# EAGLE schematic headamp (EAGLE 7.6.0)
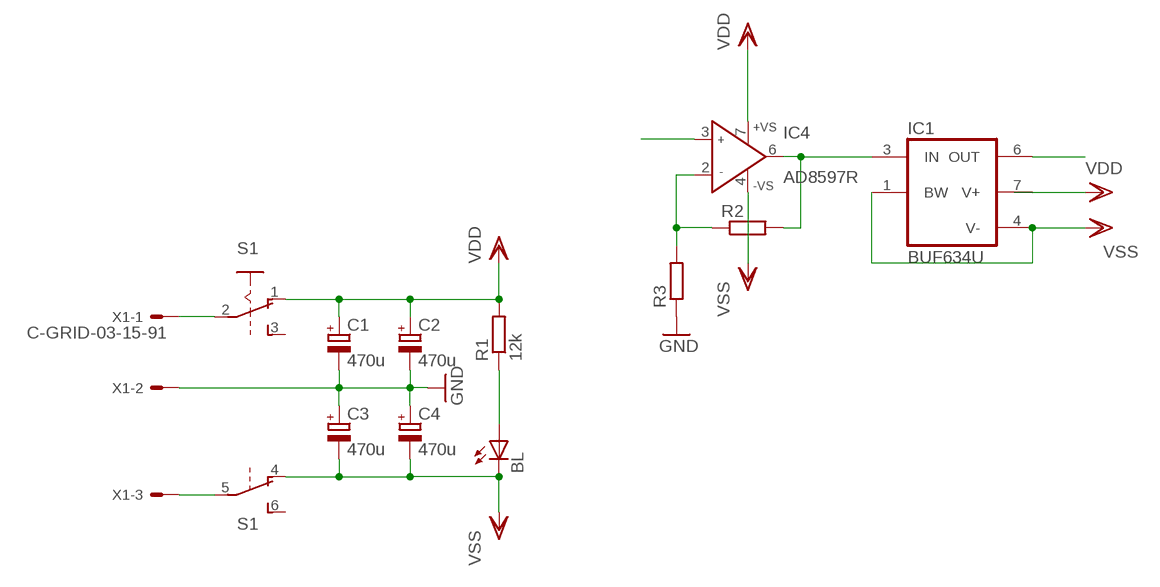
[diagram p0: schematic, sheet 1]

## Parts
BL  LEDCHIPLED_0805  [CHIPLED_0805]
C1  470u  CPOL-EUC  [PANASONIC_C]
C2  470u  CPOL-EUC  [PANASONIC_C]
C3  470u  CPOL-EUC  [PANASONIC_C]
C4  470u  CPOL-EUC  [PANASONIC_C]
IC1  BUF634U  [SO08]
IC4  AD8597R  [SO8]
R1  12k  R-EU_R0805  [R0805]
R2  R-EU_R1206  [R1206]
R3  R-EU_R1206  [R1206]
S1  A68-A31  [A68-A31]
X1  C-GRID-03-15-91  [15-91-03]

## Nets
GND: C1.- C2.- C3.+ C4.+ R3.1 X1.2
N$3: IC1.6(OUT)
N$4: S1.5(B:P) X1.3
N$6: IC1.3(IN) IC4.6(OUT) R2.2
N$7: S1.2(A:P) X1.1
N$8: BL.A R1.1
N$9: IC4.2(IN-) R2.1 R3.2
N$10: IC4.3(IN+)
VDD: C1.+ C2.+ IC4.7(+VS) R1.2 S1.1(A:O)
VSS: BL.C C3.- C4.- IC1.1(BW) IC1.4(V-) IC4.4(-VS) S1.4(B:O)
Unconnected: S1.3(A:S) S1.6(B:S)

## Power pins joined to a net without a drawn wire
V+: IC1.7(V+)

## Library data of the parts
BL = led:LED: LED OSRAM: - CHIPLED LG R971, LG N971, LY N971, LG Q971, LY Q971, LO R971, LY R971 LH N974, LH R974 LS Q976, LO Q976, LY Q976 LO Q996 - Hyper CHIPLED LW Q18S LB Q993, LB Q99A, LB R99A - SideLED LS A670, LO A670, LY A670, LG A670, LP A670 LB A673, LV A673, LT A673, LW A673 LH A674 LY A675 LS A676, LA A676, LO A676, LY A676, LW A676 LS A679, LY A679, LG A679 - Hyper Micro SIDELED® LS Y876, LA Y876, LO Y876, LY Y876 LT Y87S - SmartLED LW L88C, LW L88S LB L89C, LB L89S, LG L890 LS L89K, LO L89K, LY L89K LS L896, LA L896, LO L896, LY L896 - TOPLED LS T670, LO T670, LY T670, LG T670, LP T670 LSG T670, LSP T670, LSY T670, LOP T670, LYG T670 LG T671, LOG T671, LSG T671 LB T673, LV T673, LT T673, LW T673 LH T674 LS T676, LA T676, LO T676, LY T676, LB T676, LH T676, LSB T676, LW T676 LB T67C, LV T67C, LT T67C, LS T67K, LO T67K, LY T67K, LW E67C LS E67B, LA E67B, LO E67B, LY E67B, LB E67C, LV E67C, LT E67C LW T67C LS T679, LY T679, LG T679 LS T770, LO T770, LY T770, LG T770, LP T770 LB T773, LV T773, LT T773, LW T773 LH T774 LS E675, LA E675, LY E675, LS T675 LS T776, LA T776, LO T776, LY T776, LB T776 LHGB T686 LT T68C, LB T68C - Hyper Mini TOPLED® LB M676 - Mini TOPLED Santana® LG M470 LS M47K, LO M47K, LY M47K Source: http://www.osram.convergy.de LUXEON: - LUMILED® LXK2-PW12-R00, LXK2-PW12-S00, LXK2-PW14-U00, LXK2-PW14-V00 LXK2-PM12-R00, LXK2-PM12-S00, LXK2-PM14-U00 LXK2-PE12-Q00, LXK2-PE12-R00, LXK2-PE12-S00, LXK2-PE14-T00, LXK2-PE14-U00 LXK2-PB12-K00, LXK2-PB12-L00, LXK2-PB12-M00, LXK2-PB14-N00, LXK2-PB14-P00, LXK2-PB14-Q00 LXK2-PR12-L00, LXK2-PR12-M00, LXK2-PR14-Q00, LXK2-PR14-R00 LXK2-PD12-Q00, LXK2-PD12-R00, LXK2-PD12-S00 LXK2-PH12-R00, LXK2-PH12-S00 LXK2-PL12-P00, LXK2-PL12-Q00, LXK2-PL12-R00 Source: www.luxeon.com KINGBRIGHT: KA-3528ASYC Source: www.kingbright.com
C1-C4 = rcl:CPOL-EU: POLARIZED CAPACITOR, European symbol
IC1 = burr-brown:BUF634: 250mA High-Speed Buffer; MF: TEXAS INSTRUMENTS; MPN: BUF634U; OC_FARNELL: 4733617; OC_NEWARK: 27C6567
IC4 = analog-devices:AD8597: Single and Dual, Ultralow Distortion, Ultralow Noise Op Amps Source: http://www.analog.com/static/imported-files/data_sheets/AD8597_8599.pdf; MPN: AD8597ARZ; OC_FARNELL: 1701258; OC_NEWARK: 19P8303
R1-R3 = rcl:R-EU_: RESISTOR, European symbol
S1 = switch:A68-A31: SLIDING SWITCH Siemens, distributor Buerklin, 11G766
X1 = con-molex:C-GRID-03: CONNECTOR wire to board 2.54 mm (0.100") pitch header; OC_FARNELL: unknown; OC_NEWARK: unknown